# EAGLE design main (EAGLE 8.5.2)
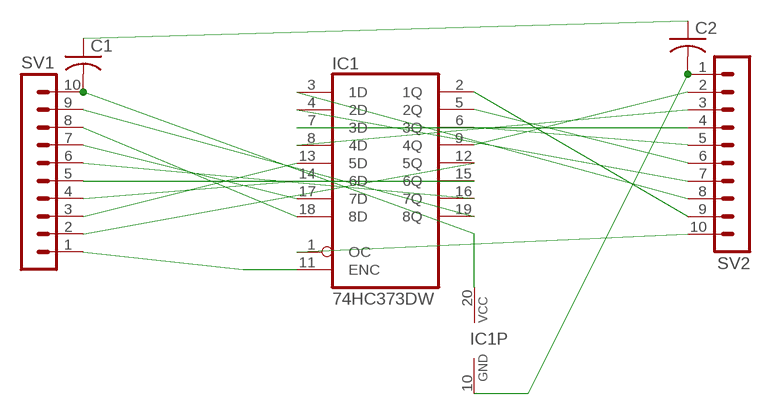
[diagram p0: schematic, sheet 1]

## Parts
C1  C-USC0603  [C0603]
C2  C-USC0603  [C0603]
IC1  74HC373DW  [SO20W]
SV1  MA10-1  [MA10-1]
SV2  MA10-1  [MA10-1]

## Nets
N$1: IC1.1(OC) SV2.10
N$2: IC1.18(8D) SV1.8
N$3: IC1.17(7D) SV1.7
N$4: IC1.14(6D) SV1.4
N$5: IC1.13(5D) SV1.3
N$6: IC1.3(1D) SV2.8
N$7: IC1.4(2D) SV2.7
N$8: IC1.12(5Q) SV1.2
N$9: IC1.15(6Q) SV1.5
N$10: IC1.2(1Q) SV2.9
N$11: IC1.5(2Q) SV2.6
N$12: IC1.6(3Q) SV2.5
N$13: IC1.9(4Q) SV2.2
N$14: IC1.16(7Q) SV1.6
N$15: IC1.19(8Q) SV1.9
N$16: IC1.7(3D) SV2.4
N$17: IC1.8(4D) SV2.3
N$18: IC1.11(ENC) SV1.1
N$19: C1.2 IC1.20(VCC) SV1.10
N$20: C2.2 IC1.10(GND) SV2.1
N$24: C1.1 C2.1

## Library data of the parts
C1 C2 = rcl:C-US: CAPACITOR, American symbol; SPICEPREFIX: C
IC1 = 74xx-eu:74*373: Octal D type transparent LATCH, edge triggered
SV1 SV2 = con-lstb:MA10-1: PIN HEADER; OC_FARNELL: unknown; OC_NEWARK: unknown

## Board
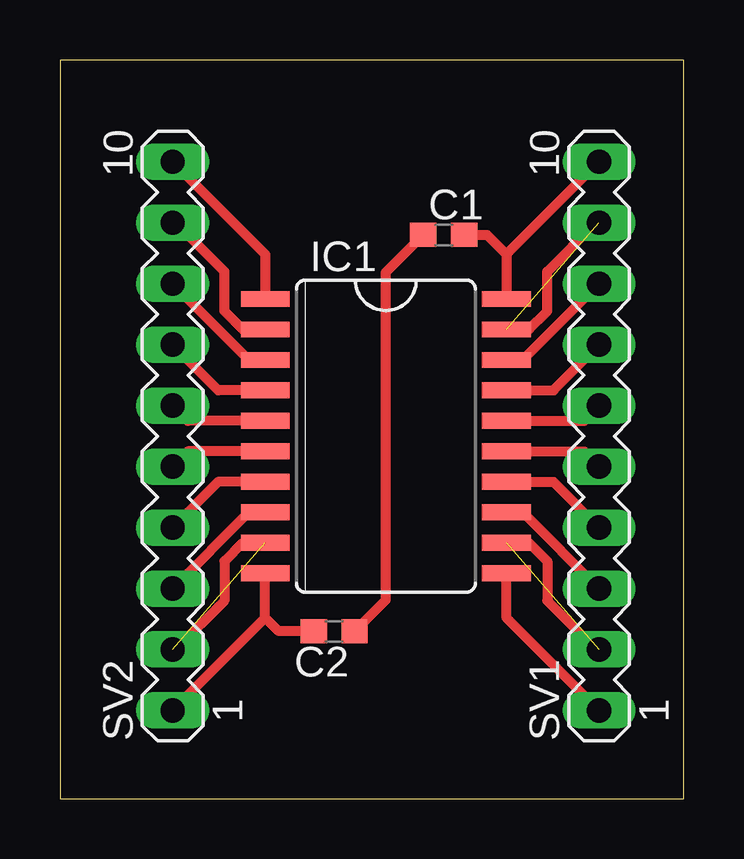
[diagram p1: board, top side]

Size 26.01 x 30.79 mm. Coordinates in mm from the lower left corner, seen from the top.
Outline: 0,0 26.01,0 26.01,30.79 0,30.79 0,0
Copper layers (1*16): Top 0.035mm / dielectric 1.5mm / Bottom 0.035mm
Design rules "default": minimum track width 6mil, minimum drill 0.35mm, track to track 6mil, track to pad 6mil, pad to pad 6mil, via to via 6mil, smd to smd 6mil, copper to edge 40mil, drill to drill 6mil, minimum pad ring 10mil, minimum via ring 8mil, stop-mask expansion 4mil, vias tented up to drill 0mil, thermal gap 10mil

### Footprints (pad centres in the part's own frame; a part is rotated, then mirrored left to right if it is on the bottom)
C0603 = smd 1.1 x 1: 1 -0.85,0; 2 0.85,0
SO20W = smd 0.66 x 2.032: 1 -5.715,-5.029; 2 -4.445,-5.029; 3 -3.175,-5.029; 4 -1.905,-5.029; 5 -0.635,-5.029; 6 0.635,-5.029; 7 1.905,-5.029; 8 3.175,-5.029; 9 4.445,-5.029; 10 5.715,-5.029; 11 5.715,5.029; 12 4.445,5.029; 13 3.175,5.029; 14 1.905,5.029; 15 0.635,5.029; 16 -0.635,5.029; 17 -1.905,5.029; 18 -3.175,5.029; 19 -4.445,5.029; 20 -5.715,5.029
MA10-1 = drill 1.016 long: 1 -11.43,0; 2 -8.89,0; 3 -6.35,0; 4 -3.81,0; 5 -1.27,0; 6 1.27,0; 7 3.81,0; 8 6.35,0; 9 8.89,0; 10 11.43,0

### Placement (x,y rotation side)
C1  16,23.5 0 top
C2  11.43,6.99 180 top
IC1  13.59,15.11 270 top
SV1  22.48,15.11 90 top
SV2  4.7,15.11 90 top

### Tracks (layer width: path | path; a pad name or v marks a point on that pad's centre or on a via)
N$1
  Top 0.406: SV2.10 8.56,22.68 IC1.1
N$2
  Top 0.406: IC1.18 19.3,18.29 SV1.8
N$3
  Top 0.406: IC1.17 20.57,17.02 SV1.7
N$4
  Top 0.406: IC1.14 20.57,13.21 SV1.4
N$5
  Top 0.406: IC1.13 19.3,11.94 SV1.3
N$6
  Top 0.406: IC1.3 7.87,18.29 SV2.8
N$7
  Top 0.406: IC1.4 6.6,17.02 SV2.7
N$8  (1 unrouted)
N$9
  Top 0.406: IC1.15 21.84,14.48 SV1.5
N$10
  Top 0.406: IC1.2 7.62,19.56 6.86,20.32 6.86,21.97 4.83,24 SV2.9
N$11
  Top 0.406: IC1.5 5.33,15.75 SV2.6
N$12
  Top 0.406: IC1.6 5.33,14.48 SV2.5
N$13  (1 unrouted)
N$14
  Top 0.406: IC1.16 21.84,15.75 SV1.6
N$15  (1 unrouted)
N$16
  Top 0.406: IC1.7 6.6,13.21 SV2.4
N$17
  Top 0.406: IC1.8 7.87,11.94 SV2.3
N$18
  Top 0.406: SV1.1 18.62,7.54 IC1.11
N$19
  Top 0.406: SV1.10 18.62,22.68 | 18.62,22.68 IC1.20 | C1.2 17.8,23.5 18.62,22.68
N$20
  Top 0.406: SV2.1 8.56,7.54 | 8.56,7.54 IC1.10 | C2.2 9.12,6.99 8.56,7.54
N$21
  Top 0.406: 18.62,10.67 19.56,10.67 20.32,9.91 20.32,8.25 22.35,6.22
N$22
  Top 0.406: 18.62,19.56 19.56,19.56 20.32,20.32 20.32,21.97 22.35,24
N$23
  Top 0.406: 8.56,10.67 7.62,10.67 6.86,9.91 6.86,8.25 4.83,6.22
N$24
  Top 0.406: C2.1 13.59,8.29 13.59,21.93 C1.1